# EAGLE design bottom (EAGLE 9.3.0)
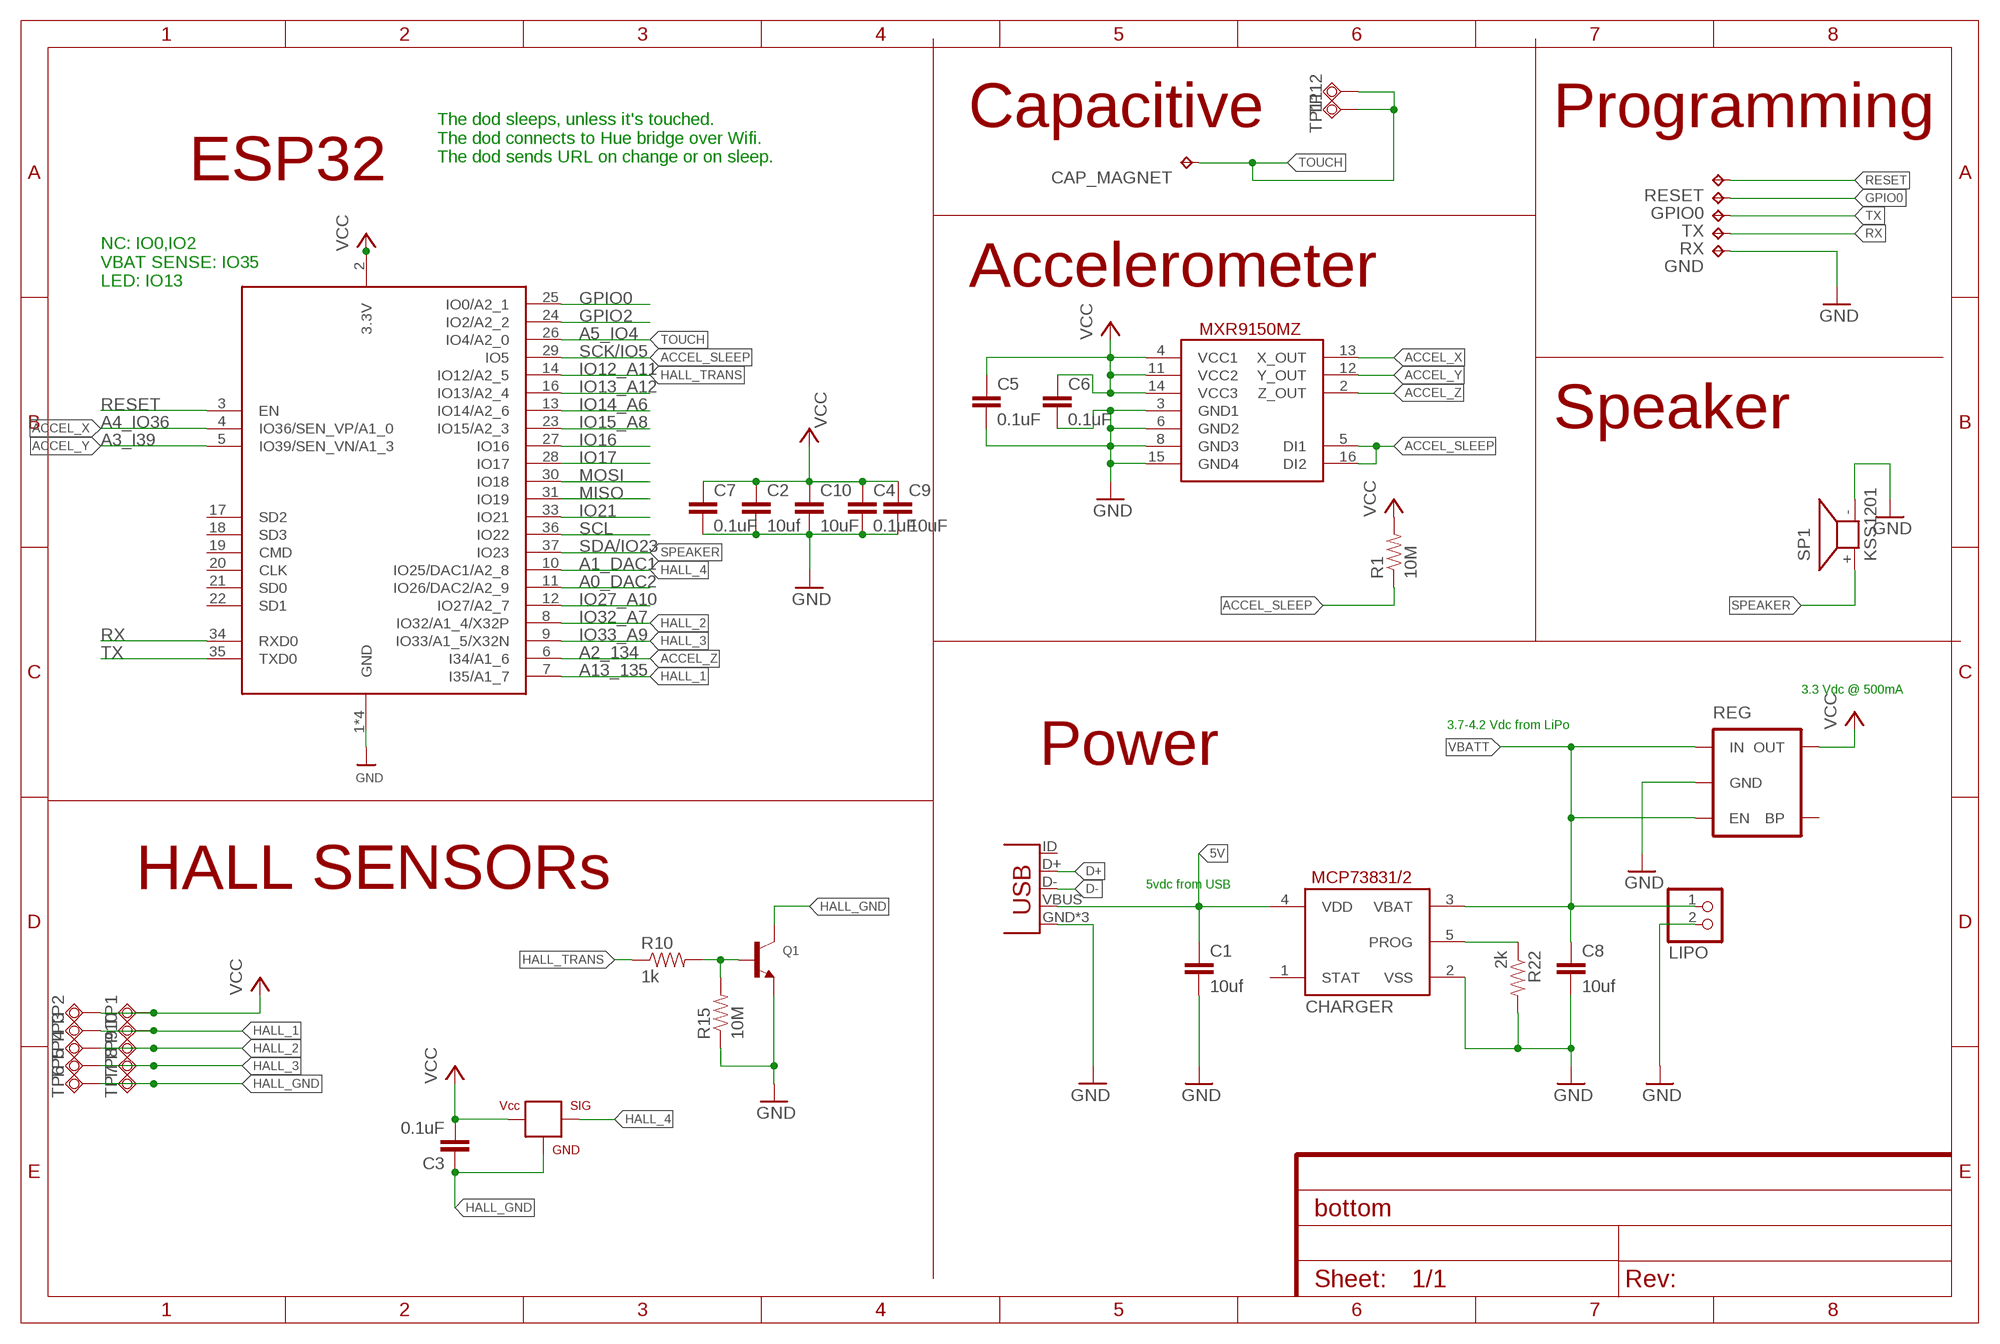
[diagram p0: schematic, sheet 1]

## Parts
C1  10uf  CAP0603-CAP  [0603-CAP]
C2  10uf  CAP0402-CAP  [0402-CAP]
C3  0.1uF  CAP0603-CAP  [0603-CAP]
C4  0.1uF  CAP0402-CAP  [0402-CAP]
C5  0.1uF  CAP0402-CAP  [0402-CAP]
C6  0.1uF  CAP0402-CAP  [0402-CAP]
C7  0.1uF  CAP0402-CAP  [0402-CAP]
C8  10uf  CAP0603-CAP  [0603-CAP]
C9  10uF  CAP0402-CAP  [0402-CAP]
C10  10uF  CAP0402-CAP  [0402-CAP]
CAP_MAGNET  TPTP10R  [TP10R]
CHARGER  MCP73831/OT  [SOT23-5L]
GND  TPTP13SQ  [TP13SQ]
GPIO0  TPTP13R  [TP13R]
HALL  A1304  HALLEFFECT-A1326  [SOT23-3]
JP1  USB-MICROB  [USB-MICROB]
LIPO  JST_2PIN-THM  [JST-PH-2-THM]
Q1  TRANSISTOR_NPN  [SOT-23-R]
R1  10M  RESISTOR0402-RES  [0402-RES]
R10  1k  RESISTOR0402-RES  [0402-RES]
R15  10M  RESISTOR0402-RES  [0402-RES]
R22  2k  RESISTOR0402-RES  [0402-RES]
REG  MIC52053.3V  [SOT23-5]
RESET  TPTP13R  [TP13R]
RX  TPTP13R  [TP13R]
SP1  KSS1201  [KSS1201]
TP1  TPSQTP10SQ  [TP10SQ]
TP2  TPSQTP10SQ  [TP10SQ]
TP3  TPSQTP10SQ  [TP10SQ]
TP4  TPSQTP10SQ  [TP10SQ]
TP5  TPSQTP10SQ  [TP10SQ]
TP6  TPSQTP10SQ  [TP10SQ]
TP7  TPSQTP10SQ  [TP10SQ]
TP8  TPSQTP10SQ  [TP10SQ]
TP9  TPSQTP10SQ  [TP10SQ]
TP10  TPSQTP10SQ  [TP10SQ]
TP11  TPSQTP10SQ  [TP10SQ]
TP12  TPSQTP10SQ  [TP10SQ]
TX  TPTP13R  [TP13R]
U$1  ACCELEROMETER_MXR9150MZ  [MXR9150MZ]
X2  ESP32_WROOM32_SKINNY  [WROOM32_SKINNY]

## Nets
5V: C1.1 CHARGER.4(VDD) JP1.VBUS
A0_DAC2: X2.11(IO26/DAC2/A2_9)
ACCEL_SLEEP: R1.1 U$1.5(DI1) U$1.16(DI2) X2.29(IO5)
ACCEL_X: U$1.13(X_OUT) X2.4(IO36/SEN_VP/A1_0)
ACCEL_Y: U$1.12(Y_OUT) X2.5(IO39/SEN_VN/A1_3)
ACCEL_Z: U$1.2(Z_OUT) X2.6(I34/A1_6)
D+: JP1.D+
D-: JP1.D-
GND: C1.2 C2.2 C4.2 C5.2 C6.2 C7.2 C8.2 C9.2 C10.2 CHARGER.2(VSS) GND.TP JP1.GND JP1.MT1(GND) JP1.MT2(GND) LIPO.2 Q1.3-EMITTER(E) R15.1 R22.2 REG.2(GND) SP1.- U$1.3(GND1) U$1.6(GND2) U$1.8(GND3) U$1.15(GND4) X2.1(GND) X2.15(GND) X2.38(GND) X2.P$1(GND)
GPIO0: GPIO0.TP X2.25(IO0/A2_1)
GPIO2: X2.24(IO2/A2_2)
HALL_1: TP3.TP TP10.TP X2.7(I35/A1_7)
HALL_2: TP4.TP TP9.TP X2.8(IO32/A1_4/X32P)
HALL_3: TP5.TP TP8.TP X2.9(IO33/A1_5/X32N)
HALL_4: HALL.2(SIG) X2.10(IO25/DAC1/A2_8)
HALL_GND: C3.1 HALL.3(GND) Q1.2-COLLECTOR(C) TP6.TP TP7.TP
HALL_TRANS: R10.1 X2.14(IO12/A2_5)
IO13_A12: X2.16(IO13/A2_4)
IO14_A6: X2.13(IO14/A2_6)
IO15_A8: X2.23(IO15/A2_3)
IO16: X2.27(IO16)
IO17: X2.28(IO17)
IO21: X2.33(IO21)
IO27_A10: X2.12(IO27/A2_7)
MISO: X2.31(IO19)
MOSI: X2.30(IO18)
N$2: CHARGER.5(PROG) R22.1
N$5: Q1.1-BASE(B) R10.2 R15.2
RESET: RESET.TP X2.3(EN)
RX: RX.TP X2.34(RXD0)
SCL: X2.36(IO22)
SPEAKER: SP1.+ X2.37(IO23)
TOUCH: CAP_MAGNET.TP TP11.TP TP12.TP X2.26(IO4/A2_0)
TX: TX.TP X2.35(TXD0)
VBATT: C8.1 CHARGER.3(VBAT) LIPO.1 REG.1(IN) REG.3(EN)
VCC: C2.1 C3.2 C4.1 C5.1 C6.1 C7.1 C9.1 C10.1 HALL.1(VCC) R1.2 REG.5(OUT) TP1.TP TP2.TP U$1.4(VCC1) U$1.11(VCC2) U$1.14(VCC3) X2.2(3.3V)
Unconnected: CHARGER.1(STAT) JP1.ID(SHIELD) REG.4(BP) X2.17(SD2) X2.18(SD3) X2.19(CMD) X2.20(CLK) X2.21(SD0) X2.22(SD1)

## Notes on the sheet
- Capacitive | Programming
- The dod sleeps, unless it's touched.
  The dod connects to Hue bridge over Wifi.
  The dod sends URL on change or on sleep.
- ESP32
- NC: IO0,IO2
  VBAT SENSE: IO35
  LED: IO13
- Accelerometer
- A5_IO4
- SCK/IO5
- IO12_A11
- IO13_A12
- IO14_A6
- A4_IO36 | IO15_A8 | Speaker
- A3_I39
- SDA/IO23
- A1_DAC1
- IO27_A10
- IO32_A7
- IO33_A9
- A2_134
- A13_135
- 3.3 Vdc @ 500mA
- 3.7-4.2 Vdc from LiPo
- Power
- HALL SENSORs | 5vdc from USB

## Library data of the parts
C1 C8 = SparkFun-Capacitors:CAP: Capacitor Standard 0603 ceramic capacitor, and 0.1" leaded capacitor.
C2-C7 C9 C10 = SparkFun:CAP: Capacitor Standard 0603 ceramic capacitor, and 0.1" leaded capacitor.
CAP_MAGNET GND GPIO0 RESET RX TX = testpad:TP: Test pad
CHARGER = adafruit:MCP73831: MCP73831/2 Miniature Single-Cell, Fully Integrated Li-Ion, Li-Polymer Charge Management Controllers. Nice and small simple lipoly charge controller, with adjustable current and status output (LED) http://www.ladyada.net/library/pcb/eaglelibrary.html
HALL = Andy_Sigler:HALLEFFECT-A1326
JP1 = Andy_Sigler:USB: USB Connectors USB-B-PTH is fully proven SKU : PRT-00139/CONN-08278 USB-miniB is fully proven SKU : PRT-00587 USB-A-PCB is untested. USB-A-H is throughly reviewed, but untested. Spark Fun Electronics SKU : PRT-00437 USB-B-SMT is throughly reviewed, but untested. Needs silkscreen touching up. USB-A-S has not been used/tested USB-MB-H has not been used/tested USB-MICROB has been used. CONN-09505; PROD_ID: CONN-09505
LIPO = adafruit:JST_2PIN: JST 2-Pin Connectors of various flavors SMT-RA (S2B-PH-SM4) 4UConnector #17311 SMT (B2B-PH-SM4) THM-RA (S2B-PH) THM (B2B-PH)
Q1 = Tomorrow_Lab_LLC:TRANSISTOR_NPN: NPN Transistor Transistor (NPN) 500mA 45V - BC817 [Digikey: 568-1631-1-ND] SOT23-R - SOT23 footprint optimised for use with solder paste and reflow ovens. SOT23-W - SOT23 footprint optimised for hand-soldering (larger pads).
R1 R10 R15 R22 = SparkFun-Passives:RESISTOR: Resistor Basic schematic elements and footprints for 0603, 1206, and PTH resistors.
REG = SparkFun-PowerIC:MIC5205: MIC5205 150mA vreg 3.3V - VREG-00822 5V - VREG-00823; PROD_ID: VREG-00822
SP1 = buzzer:KSS1201: SPEAKER Source: Schukat; OC_FARNELL: unknown; OC_NEWARK: unknown
TP1-TP12 = testpad:TPSQ: Test pad
U$1 = Andy_Sigler_2019:ACCELEROMETER_MXR9150MZ
X2 = microbuilder:ESP32_WROOM32

## Board
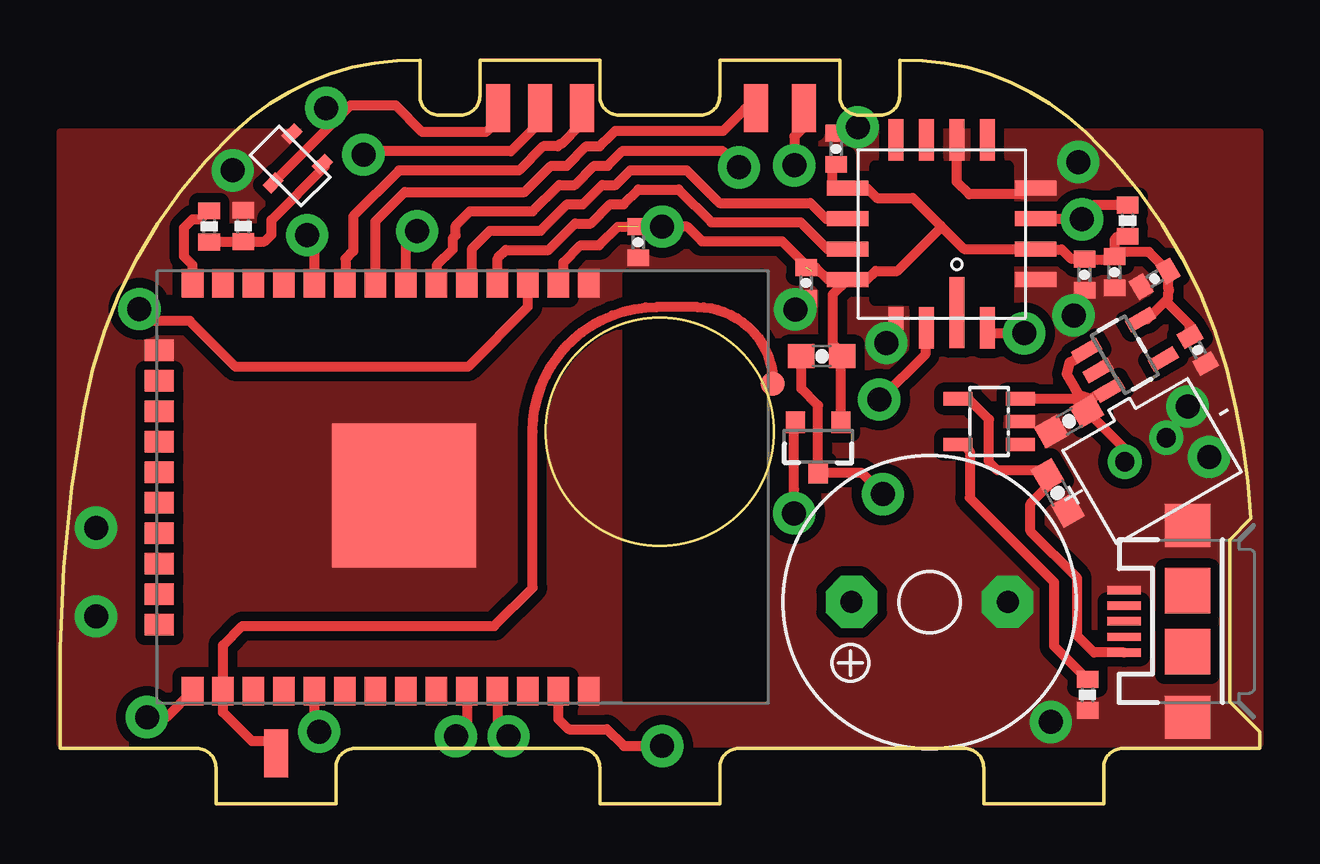
[diagram p1: board, top side]
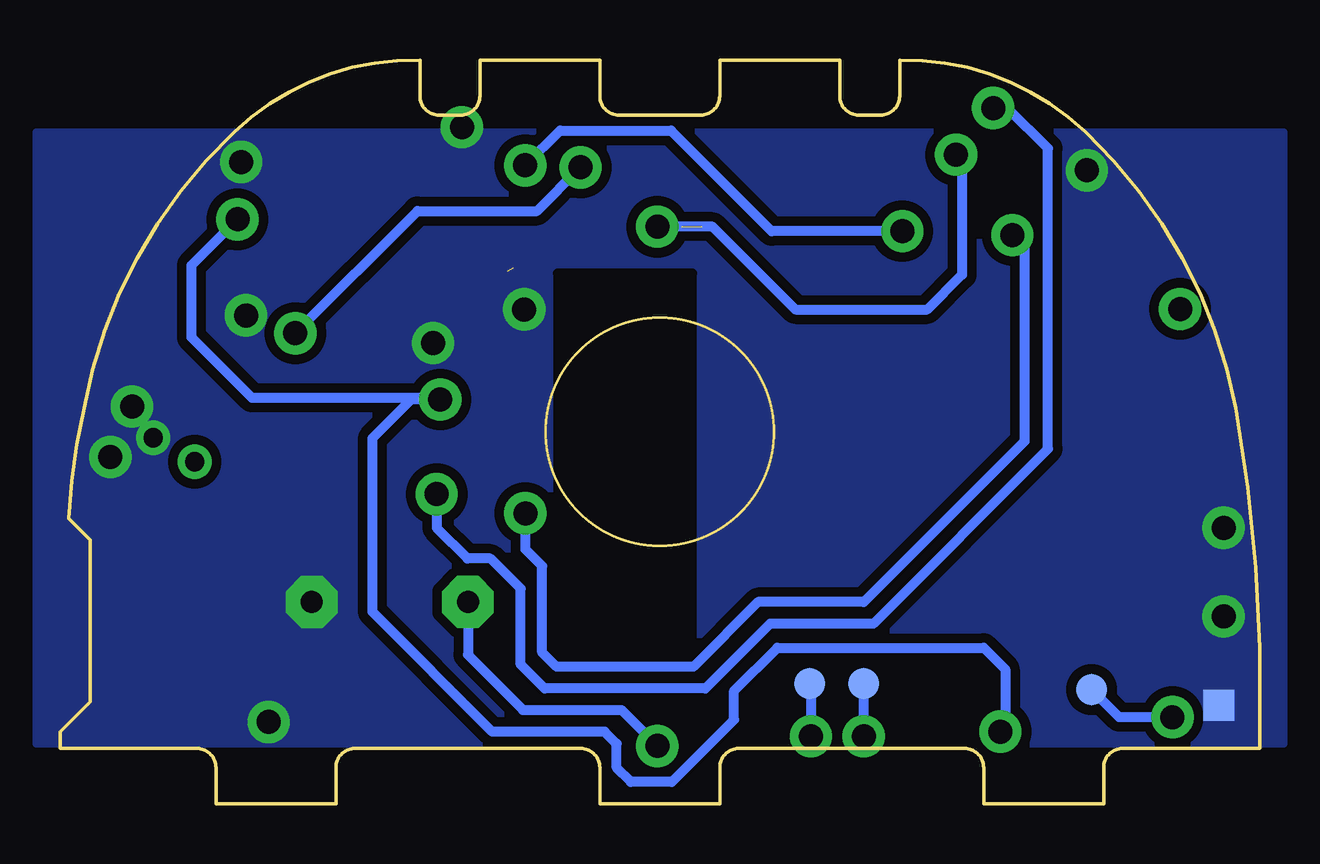
[diagram p2: board, bottom side, seen from below]

Size 50 x 31 mm. Coordinates in mm from the lower left corner, seen from the top.
Outline: 50,2.3 44.3,2.3 arc90 43.5,1.5 43.5,0 38.5,0 38.5,1.5 arc90 37.7,2.3 28.3,2.3 arc90 27.5,1.5 27.5,0 22.5,0 22.5,1.5 arc90 21.7,2.3 12.3,2.3 arc90 11.5,1.5 11.5,0 6.5,0 6.5,1.5 arc90 5.7,2.3 0,2.3 0,6.5 arc-10 1,16.5 arc-36 7.25,28 arc-45 15,31 15,29.5 arc90 15.8,28.7 16.7,28.7 arc90 17.5,29.5 17.5,31 22.5,31 22.5,29.5 arc90 23.3,28.7 26.7,28.7 arc90 27.5,29.5 27.5,31 32.5,31 32.5,29.5 arc90 33.3,28.7 34.2,28.7 arc90 35,29.5 35,31 arc-45 42.75,28 arc-36 49,16.5 arc-10 49.64,11.89 48.75,11 48.75,4.25 50,3 50,2.3
Outline: circle at 25,15.5 radius 4.76
Copper layers (1*16): Top 0.035mm / dielectric 1.5mm / Bottom 0.035mm
Design rules "OthermillDRC_1_64_v2": minimum track width 16mil, minimum drill 31mil, track to track 0.39878125mm, track to pad 0.39878125mm, pad to pad 0.39878125mm, via to via 0.39878125mm, smd to smd 0mil, copper to edge 0mil, drill to drill 1mil, minimum pad ring 0mil, minimum via ring 15mil, stop-mask expansion 1mil, vias tented up to drill 30mil, thermal gap 10mil
tRestrict: area 34,20.9 to 39.5,26.6; area 23.6,4.3 to 29.2,22.1
bRestrict: area 23.6,4.3 to 29.2,22.1

### Footprints (pad centres in the part's own frame; a part is rotated, then mirrored left to right if it is on the bottom)
0603-CAP = smd 1.1 x 1: 1 -0.85,0; 2 0.85,0
0402-CAP = smd 0.7 x 0.9: 1 -0.65,0; 2 0.65,0
TP10R = smd 1 x 1: TP 0,0
SOT23-5L = smd 0.55 x 1.2: 1 -0.95,-1.3; 2 0,-1.3; 3 0.95,-1.3; 4 0.95,1.3; 5 -0.95,1.3
TP13SQ = smd 1.3 x 1.3: TP 0,0
TP13R = smd 1.3 x 1.3: TP 0,0
SOT23-3 = smd 0.8 x 0.9: 1 -0.95,-1; 2 0.95,-1; 3 0,1.1
USB-MICROB = smd 0.35 x 1.4: D+ 0,2.65; D- -0.65,2.65; GND 1.3,2.65; ID 0.65,2.65; VBUS -1.3,2.65 | smd 1.8 x 1.9: MT1 -4,0; MT2 4,0 | smd 1.9 x 1.9: P$1 -1.27,0; P$2 1.27,0
JST-PH-2-THM = drill 0.8 pad 1.422: 1 1,0; 2 -1,0
SOT-23-R = smd 0.5 x 0.75: 1-BASE -0.9,-1; 2-COLLECTOR 0,1; 3-EMITTER 0.9,-1
0402-RES = smd 0.7 x 0.9: 1 -0.65,0; 2 0.65,0
SOT23-5 = smd 0.55 x 1.2: 1 -0.95,-1.3; 2 0,-1.3; 3 0.95,-1.3; 4 0.95,1.3; 5 -0.95,1.3
KSS1201 = drill 0.914 pad 2.159 octagon: + 3.251,0; - -3.251,0
TP10SQ = smd 1 x 1: TP 0,0
MXR9150MZ = smd 2.963 x 0.64: 1 3.281,0.635 | smd 1.722 x 0.64: 2 3.916,1.905; 7 -3.916,1.905; 8 -3.916,0.635; 9 -3.916,-0.635; 10 -3.916,-1.905; 15 3.916,-1.905; 16 3.916,-0.635 | smd 0.64 x 1.722: 3 1.905,3.916; 4 0.635,3.916; 5 -0.635,3.916; 6 -1.905,3.916; 11 -1.905,-3.916; 12 -0.635,-3.916; 13 0.635,-3.916; 14 1.905,-3.916
WROOM32_SKINNY = smd 1.2 x 0.9: 1 -8.5,5; 2 -8.5,3.73; 3 -8.5,2.46; 4 -8.5,1.19; 5 -8.5,-0.08; 6 -8.5,-1.35; 7 -8.5,-2.62; 8 -8.5,-3.89; 9 -8.5,-5.16; 10 -8.5,-6.43; 11 -8.5,-7.7; 12 -8.5,-8.97; 13 -8.5,-10.24; 14 -8.5,-11.51; 25 8.5,-11.51; 26 8.5,-10.24; 27 8.5,-8.97; 28 8.5,-7.7; 29 8.5,-6.43; 30 8.5,-5.16; 31 8.5,-3.89; 32 8.5,-2.62; 33 8.5,-1.35; 34 8.5,-0.08; 35 8.5,1.19; 36 8.5,2.46; 37 8.5,3.73; 38 8.5,5 | smd 0.9 x 1.2: 15 -5.7,-12.9; 16 -4.43,-12.9; 17 -3.16,-12.9; 18 -1.89,-12.9; 19 -0.62,-12.9; 20 0.65,-12.9; 21 1.92,-12.9; 22 3.19,-12.9; 23 4.46,-12.9; 24 5.73,-12.9 | smd 6 x 6: P$1 0.34,-2.7

### Placement (x,y rotation side)
C1  41.58,12.95 300 top
C2  43.95,22.15 270 top
C3  31.75,18.65 0 top
C4  47.43,18.91 300 top
C5  42.7,22.05 270 top
C6  32.35,27.3 90 top
C7  24.1,23.4 270 top
C8  42.07,15.93 210 top
C9  31.1,21.7 270 top
C10  45.62,21.88 210 top
CAP_MAGNET  29.7,17.5 0 top
CHARGER  38.73,15.92 90 top
GND  1.7,4.1 0 bottom
GPIO0  7,4.75 0 bottom
HALL  31.6,14.9 180 top
JP1  47,7.6 90 top
LIPO  45.25,14.75 210 top
Q1  9.6,26.58 135 top
R1  44.5,24.3 270 top
R10  6.22,24.06 270 top
R15  7.64,24.08 270 top
R22  42.83,4.53 270 top
REG  44.39,18.71 300 top
RESET  3.2,20.55 0 bottom
RX  16.5,5 0 bottom
SP1  36.25,8.4 180 top
TP1  20,28.5 180 top
TP2  20,29.5 0 top
TP3  31,28.5 270 top
TP4  29,28.5 270 top
TP5  21.75,28.5 270 top
TP6  18.25,29.5 90 top
TP7  18.25,28.5 90 top
TP8  21.75,29.5 270 top
TP9  29,29.5 270 top
TP10  31,29.5 270 top
TP11  9,2.6 0 top
TP12  9,1.6 0 top
TX  18.75,5 0 bottom
U$1  36.75,23.75 270 top
X2  17.04,13.19 270 top

### Tracks (layer width: path | path; a pad name or v marks a point on that pad's centre or on a via)
5V
  Top 0.406: CHARGER.4 37.87,16.87 38.73,16.02 38.73,14.25 39.08,13.9 40.95,13.9 C1.1 41.16,13.21 40.45,12.51 40.45,11.35 42.4,9.4 42.4,7 43.1,6.3 JP1.VBUS
ACCEL_SLEEP  (via drill 1)
  Top 0.406: U$1.16 36.07,19.79 36.07,18.72 34.19,16.84 v34.15,16.84 | U$1.5 42.57,24.39 | 42.57,24.39 v42.6,24.36 | R1.1 43.13,24.95 42.57,24.39 | v10.8,3 10.61,3.19 X2.29
  Bottom 0.406: v42.6,24.36 44.52,22.43 44.52,19.44 42.01,16.93 34.23,16.93 v34.15,16.84 35.35,16.84 36.98,15.21 36.98,8 31.98,3 27.3,3 26.8,2.5 26.8,1.5 26.2,0.9 24.5,0.9 21.9,3.5 21.9,4.7 20.1,6.5 11.5,6.5 10.6,5.6 10.6,3.2 v10.8,3
ACCEL_X
  Top 0.406: X2.4 18.25,21.71 18.25,22.74 18.59,23.08 20.37,23.08 21.47,24.18 22.13,24.18 22.93,24.98 23.5,24.98 24.11,25.59 25.79,25.59 27.15,24.23 30.87,24.23 32,23.1 U$1.13
ACCEL_Y
  Top 0.406: X2.5 17.18,21.91 17.18,23.14 17.92,23.88 20.04,23.88 21.14,24.98 21.8,24.98 22.6,25.79 23.17,25.79 23.78,26.4 26.12,26.4 27.49,25.04 31.28,25.04 31.93,24.39 U$1.12
ACCEL_Z  (via drill 1)
  Top 0.406: X2.6 15.71,21.71 15.71,22.44 16.37,23.1 16.37,23.57 16.49,23.69 16.49,24.09 17.09,24.69 19.71,24.69 20.8,25.79 21.46,25.79 22.27,26.59 22.83,26.59 23.45,27.21 27.61,27.21 v28.3,26.52 | U$1.2 38.88,19.61 v40.19,19.61
  Bottom 0.406: v40.19,19.61 35.1,24.7 30.12,24.7 v28.3,26.52
GND  (via drill 1)
  Top 0.406: U$1.6 40.35,25.66 40.1,25.4 37.9,25.4 37.38,25.91 U$1.8
  other vias: 30.65,20.6 1.5,11.5 7.2,26.4 1.5,7.8 41.3,3.4 47,16.55 47.9,14.45 42.25,20.35 33.25,28.2 34.45,19.2 42.45,26.75
  pour Top (no thermals): 0,28 50,28 50,2.5 0,2.5
  pour Bottom (no thermals): -1,28 51,28 51,2.5 -1,2.5
GPIO0  (via drill 1)
  Top 0.406: X2.25 4.44,3.6 v3.63,3.6
  Bottom 0.406: v3.63,3.6 5.85,3.6 GPIO0.TP
HALL_1  (via drill 1)
  Top 0.406: X2.7 14.42,23.39 v14.89,23.86 | v30.61,26.61 30.61,27.8 31,28.2 TP10.TP 31,28.64 30.95,28.59 31,28.55 TP3.TP
  Bottom 0.406: v14.89,23.86 20.34,23.86 24.53,28.05 29.16,28.05 v30.61,26.61
HALL_2
  Top 0.406: X2.8 13.15,24.27 14.37,25.5 19.37,25.5 20.47,26.59 21.13,26.59 21.93,27.4 22.5,27.4 23,27.9 | 23,27.9 | 23,27.9 23.15,28.05 27.65,28.05 28.55,28.95 TP4.TP TP9.TP
HALL_3
  Top 0.406: 11.91,21.72 X2.9 | X2.9 11.83,21.74 | X2.9 11.9,21.71 11.9,22.7 12.23,23.03 12.23,24.49 14.13,26.39 19.13,26.39 20.14,27.4 20.75,27.4 20.85,27.5 20.9,27.5 21.68,28.29 21.68,28.43 TP5.TP TP8.TP
HALL_4  (via drill 1)
  Top 0.406: 10.63,21.71 X2.10 10.61,23.39 v10.3,23.7 | v30.6,12.1 30.6,13.1 30.6,15.85 HALL.2
  Bottom 0.406: v10.3,23.7 9.8,23.2 9.8,15.1 16.5,8.4 20.9,8.4 23.6,5.7 29.3,5.7 29.9,6.3 29.9,9.9 30.6,10.6 v30.6,12.1
HALL_GND  (via drill 1)
  Top 0.406: Q1.2-COLLECTOR 8.89,25.89 11.1,28.1 | 11.1,28.1 12.1,29.1 14,29.1 15.1,28 17.75,28 TP7.TP TP6.TP | v11.1,29 11.1,28.1 | v34.3,12.9 33.4,13.8 HALL.3 31.6,16.6 30.9,17.3 C3.1
  Bottom 0.406: v11.1,29 10.5,29 8.82,27.31 8.82,14.78 16.1,7.5 20.4,7.5 23.1,4.8 29.8,4.8 30.8,5.8 30.8,8.96 32.06,10.22 33.02,10.22 34.3,11.5 v34.3,12.9
HALL_TRANS
  Top 0.406: R10.1 5.87,24.36 5.52,24.36 5.17,24.01 5.17,22.81 5.53,22.45 X2.14
N$2
  Top 0.406: CHARGER.5 37.63,14.97 37.92,14.68 37.92,12.74 41.43,9.23 41.43,6.57 R22.1
N$5
  Top 0.406: 11.04,26.55 8.82,24.33 8.82,23.72 8.53,23.43 R15.2 6.24,23.43 R10.2 | Q1.1-BASE 11.04,26.55 | 11.04,26.55
RESET  (via drill 1)
  Top 0.406: X2.3 19.5,20.7 17,18.2 7.33,18.2 5.41,20.12 3.81,20.12 v3.31,20.62
  Bottom 0.406: v3.31,20.62 3.24,20.55 RESET.TP
RX  (via drill 1)
  Top 0.406: X2.34 16.96,3.26 v16.5,2.8
  Bottom 0.406: v16.5,2.8 RX.TP
SPEAKER  (via drill 1)
  Top 0.406: X2.37 20.77,3.53 21.2,3.1 22.8,3.1 23.5,2.4 v25.1,2.4
  Bottom 0.406: SP1.+ 33,6.2 30.7,3.9 26.6,3.9 v25.1,2.4
TOUCH
  Top 0.406: CAP_MAGNET.TP 29.73,17.52 arc90 26.55,20.7 24.9,20.7 arc90 19.7,15.5 19.7,9 18.1,7.4 7.6,7.4 6.8,6.6 X2.26 6.8,3.8 8,2.6 TP11.TP TP12.TP
TX  (via drill 1)
  Top 0.406: X2.35 18.23,3.27 v18.7,2.8
  Bottom 0.406: TX.TP 18.7,4.95 v18.7,2.8
VBATT
  Top 0.406: 42.92,18.88 REG.1 42.79,18.8 42.09,18.39 41.96,17.91 42.36,17.22 42.48,17 | 43.69,17.29 REG.3 43.59,17.23 42.97,16.87 42.48,17 | 42.3,16.86 CHARGER.3 | 42.3,16.86 C8.1 44.38,14.78 LIPO.1 | 42.48,17 42.35,16.86 42.3,16.86
VCC  (via drill 1)  (2 unrouted)
  Top 0.406: v12.65,27.05 12.79,27.2 18.8,27.2 20,28.4 TP1.TP TP2.TP | R1.2 44.1,23.65 43.95,23.5 43.95,23 | 43.95,23 C2.1 | C2.1 43.8,22.65 42.75,22.65 C5.1 42.16,22.7 41.76,23.1 U$1.4 37.69,23.11 36.7,24.1 | REG.5 45.31,20.18 46.03,20.9 46.1,20.94 | C2.1 44.05,22.7 | 43.95,23 45.39,23 C10.1 46.18,21.51 46.23,21.42 46.18,21.24 46.18,21.05 46.11,20.98 46.1,20.94 | 36.7,24.1 35.55,25.25 34.05,25.25 33.65,25.66 U$1.11 32.79,25.7 32.2,25.7 32.2,26.5 C6.1 | U$1.14 33.65,21.84 34,22.2 34.9,22.2 36.7,24 36.7,24.1 | X2.2 20.99,21.91 20.99,22.55 21.7,23.27 22.47,23.27 23.25,24.05 v25.1,24.05 26.15,24.05 26.75,23.45 30.1,23.45 31.35,22.2 31.5,22.35 32,21.84 U$1.14 | C4.1 47.1,19.94 46.1,20.94 | HALL.1 32.55,18.6 C3.2 32.6,18.75 32.2,19.15 32.2,21.21 U$1.14
  Bottom 0.406: v25.1,24.05 22.8,24.05 19.35,20.6 13.85,20.6 12.4,22.05 12.4,26.8 v12.65,27.05